# EAGLE design mini-plasma-driver (EAGLE 9.1.1)
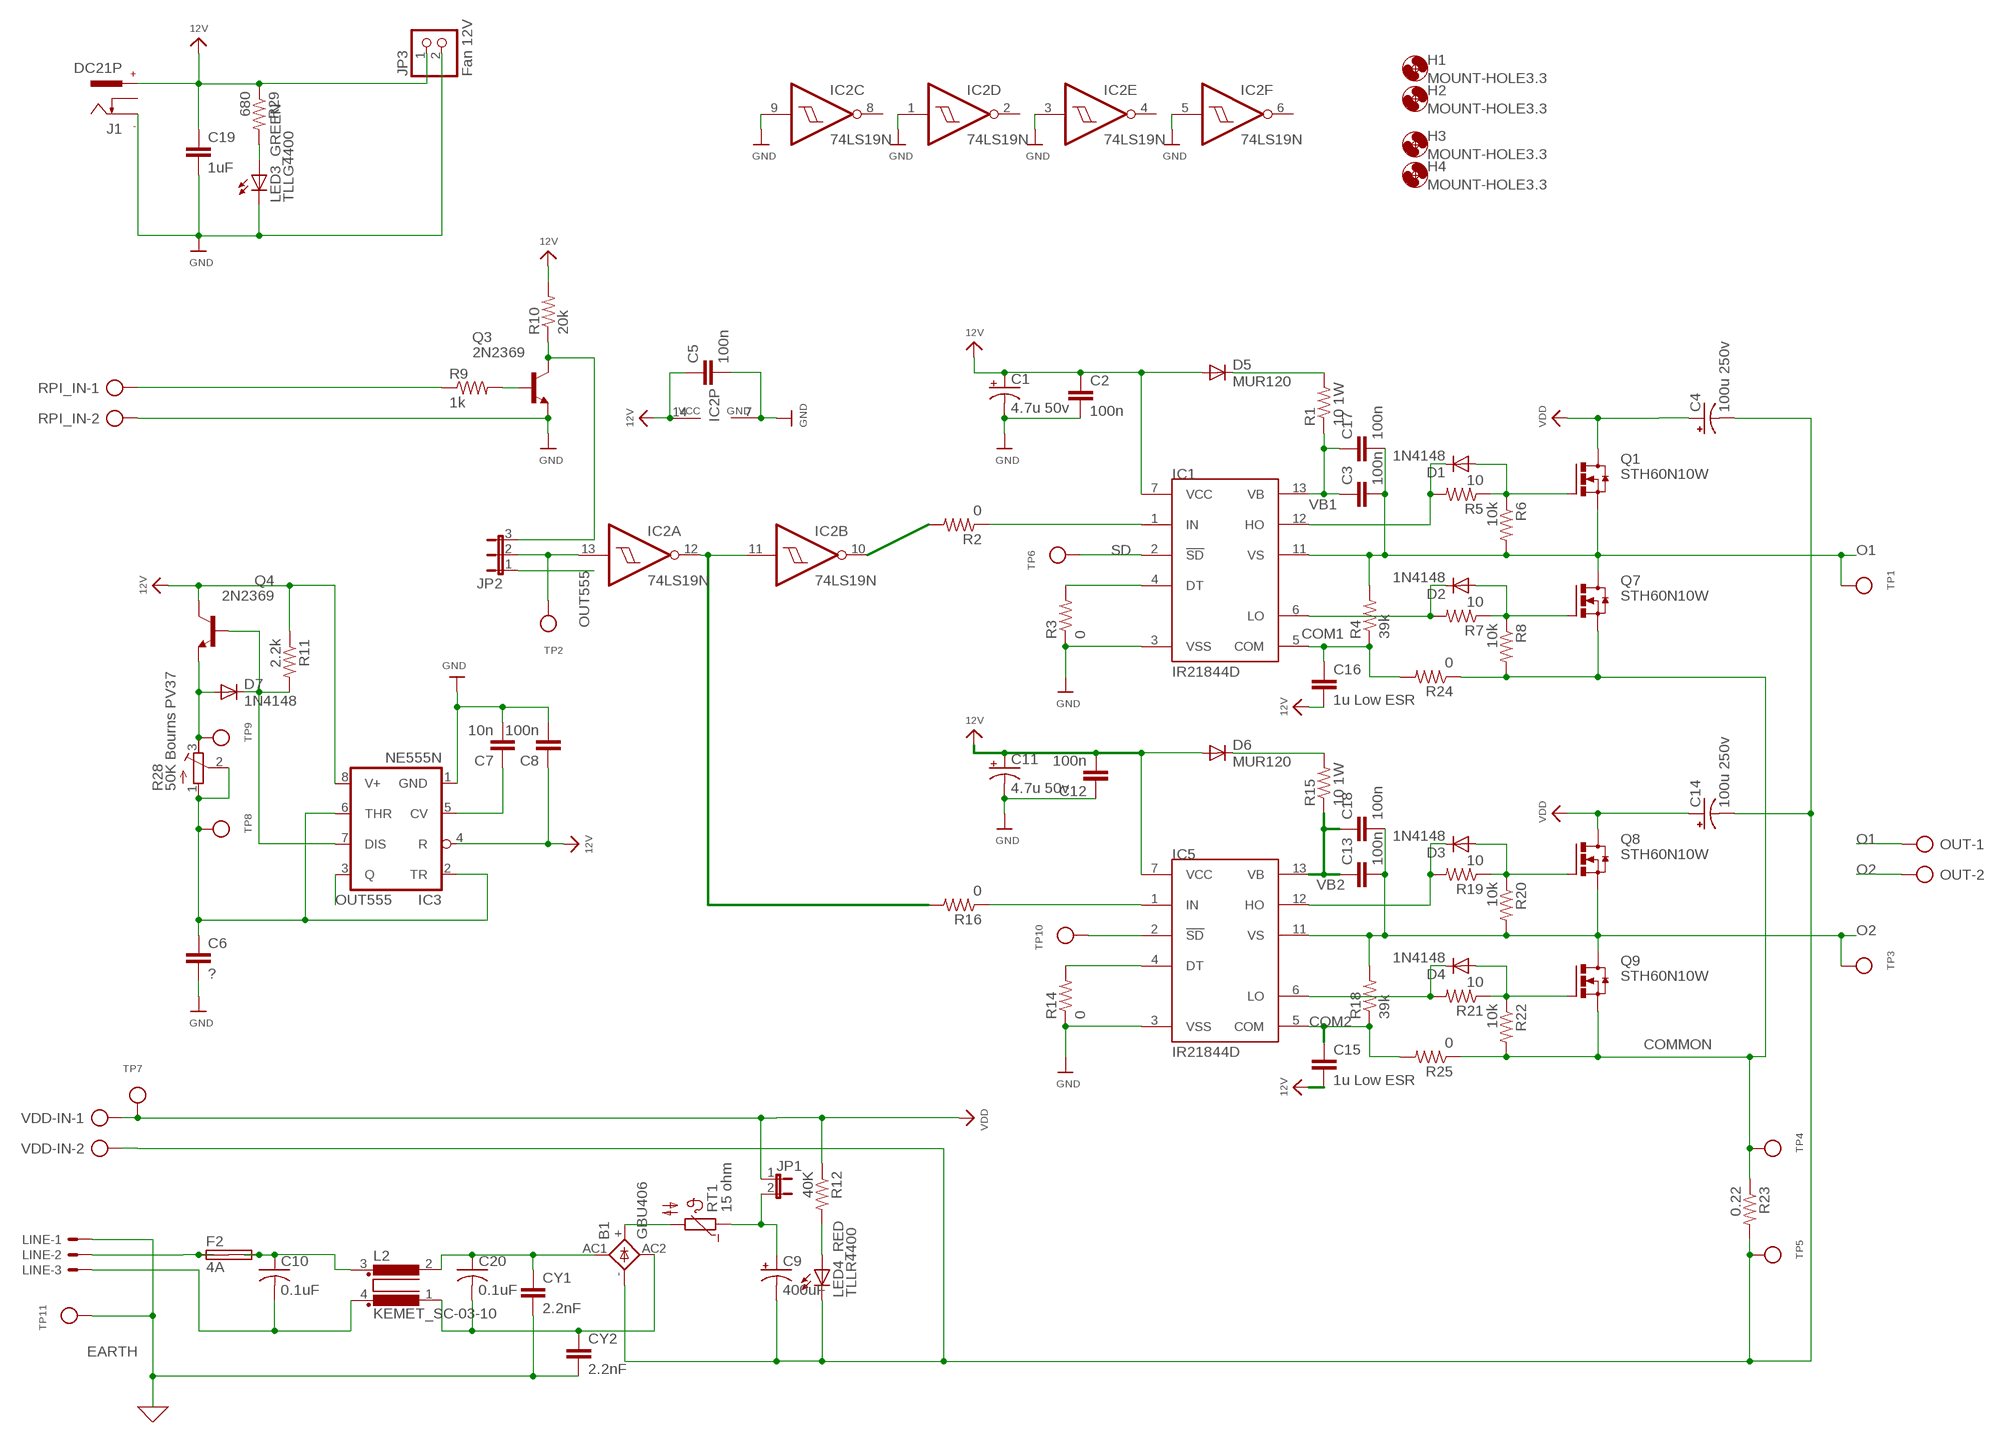
[diagram p0: schematic, sheet 1]

## Parts
B1  GBU406  2KBB-R  [2KBB-R]
C1  4.7u 50v  CPOL-USE2-5  [E2-5]
C2  100n  C-EU025-025X050  [C025-025X050]
C3  100n  C-EU025-030X050  [C025-030X050]
C4  100u 250v  CPOL-USE7.5-18  [E7,5-18]
C5  100n  C-EU025-030X050  [C025-030X050]
C6  ?  C-EU025-025X050  [C025-025X050]
C7  10n  C-EU025-030X050  [C025-030X050]
C8  100n  C-EU025-030X050  [C025-030X050]
C9  400uF  CPOL-USE7.5-18  [E7,5-18]
C10  0.1uF  C-US150-084X183  [C150-084X183]
C11  4.7u 50v  CPOL-USE2-5  [E2-5]
C12  100n  C-EU025-025X050  [C025-025X050]
C13  100n  C-EU025-030X050  [C025-030X050]
C14  100u 250v  CPOL-USE7.5-18  [E7,5-18]
C15  1u Low ESR  C-EU025-025X050  [C025-025X050]
C16  1u Low ESR  C-EU025-025X050  [C025-025X050]
C17  100n  C-EU025-030X050  [C025-030X050]
C18  100n  C-EU025-030X050  [C025-030X050]
C19  1uF  C-EU025-025X050  [C025-025X050]
C20  0.1uF  C-US150-084X183  [C150-084X183]
CY1  2.2nF  C-EU025-025X050  [C025-025X050]
CY2  2.2nF  C-EU025-025X050  [C025-025X050]
D1  1N4148  1N4148DO35-10  [DO35-10]
D2  1N4148  1N4148DO35-10  [DO35-10]
D3  1N4148  1N4148DO35-10  [DO35-10]
D4  1N4148  1N4148DO35-10  [DO35-10]
D5  MUR120  VERTICAL-DIODE  [0309V]
D6  MUR120  VERTICAL-DIODE  [0309V]
D7  1N4148  1N4148DO35-10  [DO35-10]
F2  4A  SHK20Q  [SHK20Q]
H1  MOUNT-HOLE3.3  [3,3]
H2  MOUNT-HOLE3.3  [3,3]
H3  MOUNT-HOLE3.3  [3,3]
H4  MOUNT-HOLE3.3  [3,3]
IC1  IR21844D  [DIL14]
IC2  74LS19N  [DIL14]
IC3  NE555N  [DIL08]
IC5  IR21844D  [DIL14]
J1  DC21P  [CUI-PJ-102AH]
JP1  JP1E  [JP1]
JP2  JP2E  [JP2]
JP3  Fan 12V  PINHD-1X2  [1X02]
L2  KEMET_SC-03-10  [KEMET_SC-03-10]
LED3_GREEN  TLLG4400  [LED3MM]
LED4_RED  TLLR4400  [LED3MM]
LINE  KK-156-3  [KK-156-3]
OUT  AK500/2  [AK500/2]
Q1  STH60N10W  [TO-247AD-V]
Q3  2N2369  [TO18]
Q4  2N2369  [TO18]
Q7  STH60N10W  [TO-247AD-V]
Q8  STH60N10W  [TO-247AD-V]
Q9  STH60N10W  [TO-247AD-V]
R1  10 1W  R-US_0309/V  [0309V]
R2  0  R-US_0207/10  [0207/10]
R3  0  R-US_0309/V  [0309V]
R4  39k  R-US_0207/10  [0207/10]
R5  10  R-US_0207/10  [0207/10]
R6  10k  R-US_0207/10  [0207/10]
R7  10  R-US_0207/10  [0207/10]
R8  10k  R-US_0207/10  [0207/10]
R9  1k  R-US_0207/10  [0207/10]
R10  20k  R-US_0207/10  [0207/10]
R11  2.2k  R-US_0207/10  [0207/10]
R12  40K  R-US_0207/10  [0207/10]
R14  0  R-US_0309/V  [0309V]
R15  10 1W  R-US_0309/V  [0309V]
R16  0  R-US_0207/10  [0207/10]
R18  39k  R-US_0207/10  [0207/10]
R19  10  R-US_0207/10  [0207/10]
R20  10k  R-US_0207/10  [0207/10]
R21  10  R-US_0207/10  [0207/10]
R22  10k  R-US_0207/10  [0207/10]
R23  0.22  R-US_0617/17  [0617/17]
R24  0  R-US_0207/10  [0207/10]
R25  0  R-US_0207/10  [0207/10]
R28  50K Bourns PV37  R-TRIMM3296Y  [RTRIM3296Y]
R29  680  R-US_0207/10  [0207/10]
RPI_IN  AK500/2  [AK500/2]
RT1  15 ohm  B57164  [B57164]
TP1  TESTPOINT0.1"  [1X01_ROUND]
TP2  TESTPOINT0.1"  [1X01_ROUND]
TP3  TESTPOINT0.1"  [1X01_ROUND]
TP4  TESTPOINT0.1"  [1X01_ROUND]
TP5  TESTPOINT0.1"  [1X01_ROUND]
TP6  TESTPOINT0.1"  [1X01_ROUND]
TP7  TESTPOINT0.1"  [1X01_ROUND]
TP8  TESTPOINT0.1"  [1X01_ROUND]
TP9  TESTPOINT0.1"  [1X01_ROUND]
TP10  TESTPOINT0.1"  [1X01_ROUND]
TP11  TESTPOINT0.1"  [1X01_ROUND]
VDD-IN  AK500/2  [AK500/2]

## Nets
12V: C1.+ C2.1 C5.1 C8.1 C11.+ C12.2 C15.2 C16.2 C19.1 D5.A D6.A IC1.7(VCC) IC2.14(P:VCC) IC3.4(R) IC3.8(V+) IC5.7(VCC) J1.+ JP3.1 Q4.3(C) R10.2 R11.1 R29.1
COM1: C16.1 IC1.5(COM) R4.1 R24.2
COM2: C15.1 IC5.5(COM) R18.1 R25.2
COMMON: Q7.S Q9.S R8.2 R22.2 R23.1 R24.1 R25.1 TP4.1
EARTH: CY1.2 CY2.2 LINE.1 TP11.1 ; supply symbol labelled GND
GND: C1.- C2.2 C5.2 C6.2 C7.2 C8.2 C11.- C12.1 C19.2 IC1.3(VSS) IC2.1(D:I) IC2.3(E:I) IC2.5(F:I) IC2.7(P:GND) IC2.9(C:I) IC3.1(GND) IC5.3(VSS) J1.- JP3.2 LED3_GREEN.K(C) Q3.1(E) R3.1 R14.1 RPI_IN.2
N$1: D5.C R1.2
N$2: C9.+ JP1.2 RT1.1
N$3: IC1.1(IN) R2.1
N$4: IC2.10(B:O) R2.2
N$5: D1.C IC1.12(HO) R5.2
N$6: IC1.4(DT) R3.2
N$7: D1.A Q1.G R5.1 R6.1
N$8: D2.C IC1.6(LO) R7.2
N$9: D2.A Q7.G R7.1 R8.1
N$10: R9.1 RPI_IN.1
N$11: Q3.2(B) R9.2
N$12: JP2.3 Q3.3(C) R10.1
N$13: IC2.13(A:I) JP2.2 TP2.1
N$14: D7.C IC3.7(DIS) Q4.2(B) R11.2
N$15: C6.1 IC3.2(TR) IC3.6(THR) R28.1(A) R28.2(S) TP8.1
N$16: D7.A Q4.1(E) R28.3(E) TP9.1
N$17: C7.1 IC3.5(CV)
N$18: C10.1 F2.2A F2.2B L2.3
N$19: F2.1A F2.1B LINE.2
N$20: B1.AC1 C20.1 CY1.1 L2.2
N$21: D6.C R15.2
N$22: C10.2 L2.4 LINE.3
N$23: IC5.1(IN) R16.1
N$25: B1.+ RT1.2
N$26: IC5.4(DT) R14.2
N$27: D3.C IC5.12(HO) R19.2
N$28: D3.A Q8.G R19.1 R20.1
N$29: D4.C IC5.6(LO) R21.2
N$30: D4.A Q9.G R21.1 R22.1
N$31: B1.AC2 C20.2 CY2.1 L2.1
N$32: LED4_RED.A R12.2
N$33: IC5.2(!SD) TP10.1
N$34: LED3_GREEN.A R29.2
N$36: IC2.11(B:I) IC2.12(A:O) R16.2
O1: C3.2 C17.2 IC1.11(VS) OUT.1 Q1.S Q7.D R4.2 R6.2 TP1.1
O2: C13.2 C18.2 IC5.11(VS) OUT.2 Q8.S Q9.D R18.2 R20.2 TP3.1
OUT555: IC3.3(Q) JP2.1
SD: IC1.2(!SD) TP6.1
VB1: C3.1 C17.1 IC1.13(VB) R1.1
VB2: C13.1 C18.1 IC5.13(VB) R15.1
VDD+: C4.+ C14.+ JP1.1 Q1.D Q8.D R12.1 TP7.1 VDD-IN.1 ; supply symbol labelled VDD
VDD-: B1.- C4.- C9.- C14.- LED4_RED.K(C) R23.2 TP5.1 VDD-IN.2
Unconnected: IC2.2(D:O) IC2.4(E:O) IC2.6(F:O) IC2.8(C:O) J1.C

## Library data of the parts
B1 = rectifier:2KBB-R: RECTIFIER grid 3 x 5 mm
C1 C4 C9 C11 C14 = rcl:CPOL-US: POLARIZED CAPACITOR, American symbol; SPICEPREFIX: C
C2 C3 C5-C8 C12 C13 C15-C19 CY1 CY2 = rcl:C-EU: CAPACITOR, European symbol; SPICEPREFIX: C
C10 C20 = rcl:C-US: CAPACITOR, American symbol; SPICEPREFIX: C
D1-D4 D7 = diode:1N4148: DIODE high speed (Philips)
D5 D6 = keves-ng:VERTICAL-DIODE
F2 = fuse:SHK20Q: FUSE HOLDER 5 x 20 mm, SH contact, E1207 Buerklin 64G6061; OC_FARNELL: unknown; OC_NEWARK: unknown
H1-H4 = holes:MOUNT-HOLE: MOUNTING HOLE with drill center marker
IC1 IC5 = irs:IR21844
IC2 = 74xx-eu:74*19: Hex schmitt trigger INVERTER
IC3 = linear:*555: TIMER
J1 = keves:DC21P: DC 2.1 mm Power Socket Positive Centre
JP1 = jumper:JP1E: JUMPER
JP2 = jumper:JP2E: JUMPER
JP3 = pinhead:PINHD-1X2: PIN HEADER
L2 = CdF Common:KEMET_SC-03-10: FILTER
LED3_GREEN = led:TLLG4400: Low Current (2mA) LED 3 mm Tinted Diffused Package color GREEN Source: Data sheet <http://www.farnell.com/datasheets/391098.pdf>; MF: VISHAY SEMICONDUCTOR; OC_FARNELL: 1612435
LED4_RED = led:TLLR4400: Low Current (2mA) LED 3 mm Tinted Diffused Package color RED Source: Data sheet <http://www.farnell.com/datasheets/391100.pdf>; MF: VISHAY SEMICONDUCTOR; OC_FARNELL: 1612437
LINE = con-molex:KK-156-3: KK 156 HEADER Source: http://www.molex.com/pdm_docs/sd/026604100_sd.pdf; MF: MOLEX; OC_FARNELL: unknown; OC_NEWARK: unknown
OUT RPI_IN VDD-IN = con-ptr500:AK500/2: CONNECTOR; OC_FARNELL: unknown; OC_NEWARK: unknown
Q1 Q7-Q9 = transistor-power:ST*60N10: N - CHANNEL ENHANCEMENT MODE POWER MOS TRANSISTOR Source: SGS-THOMSON .. STW60N10 1.pdf
Q3 Q4 = transistor-npn:2N2369*: NPN Transistor
R1-R12 R14-R16 R18-R25 R29 = rcl:R-US_: RESISTOR, American symbol; SPICEPREFIX: R
R28 = rcl:R-TRIMM: Trimm resistor; SPICEMODEL: X; SPICEPREFIXL: POT
RT1 = ptc-ntc:B57164: SIEMENS NTC; MPN: B57164K474K52; OC_FARNELL: 9753451; OC_NEWARK: 29M3118
TP1-TP11 = microbuilder:TESTPOINT: Test Point Various test points for characterisation and PCB testing TESTPOINT_SMT - Compact Surface Mount Test Point [Digikey: 5016KTR-ND]; BOM: EXCLUDE

## Board
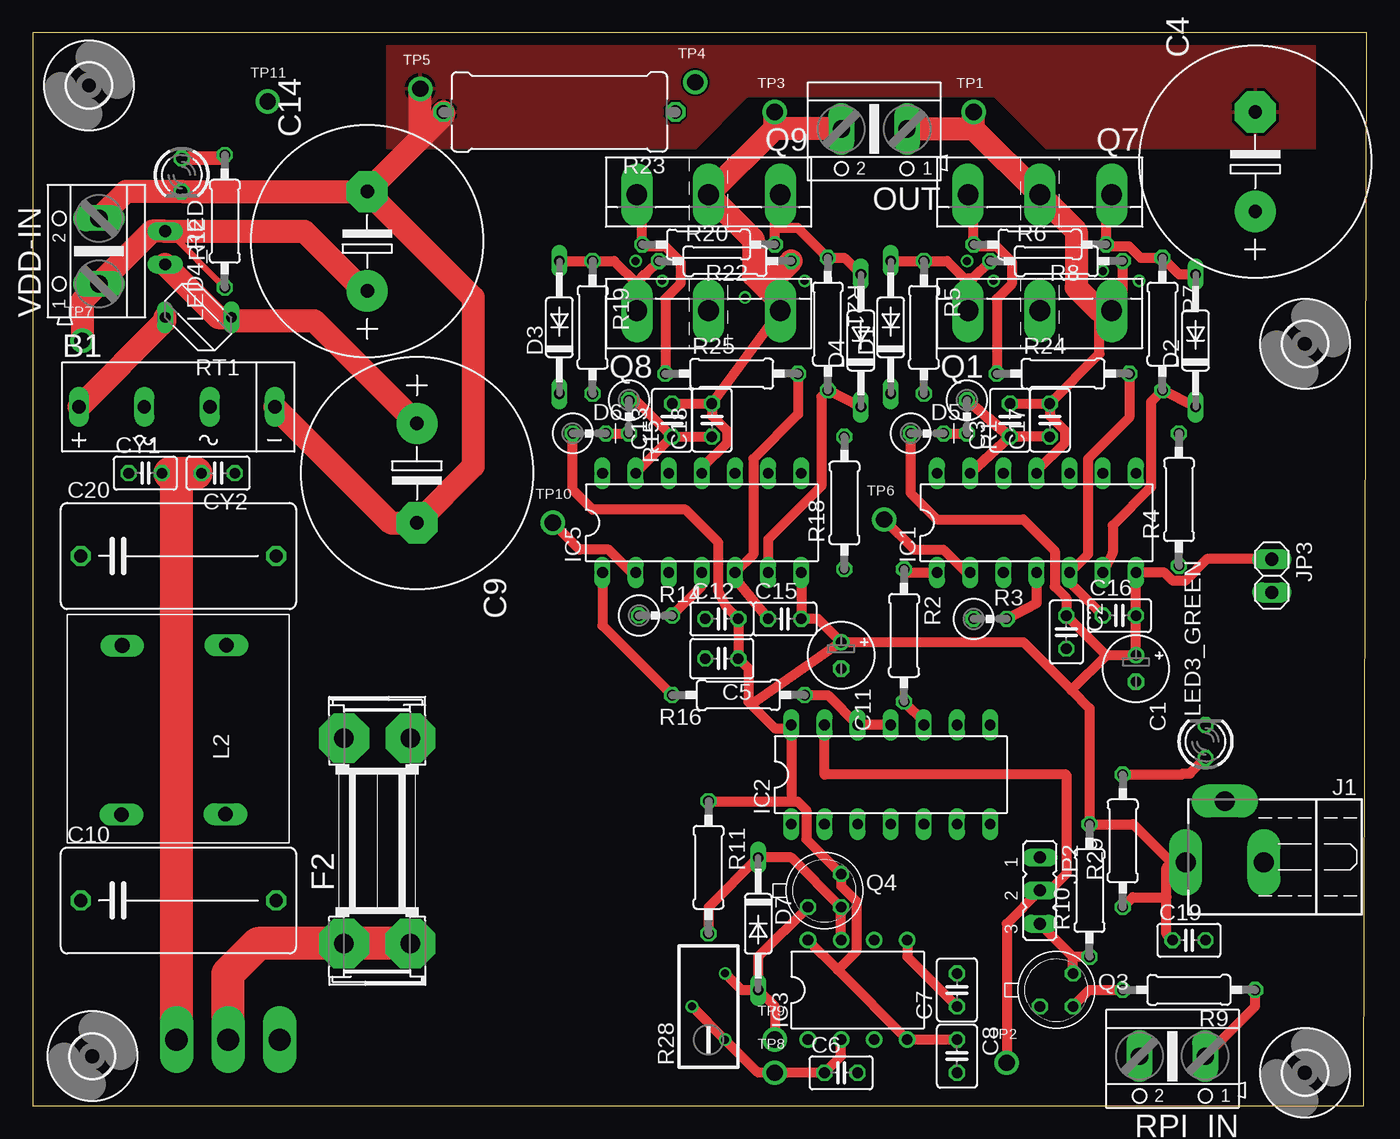
[diagram p1: board, top side]
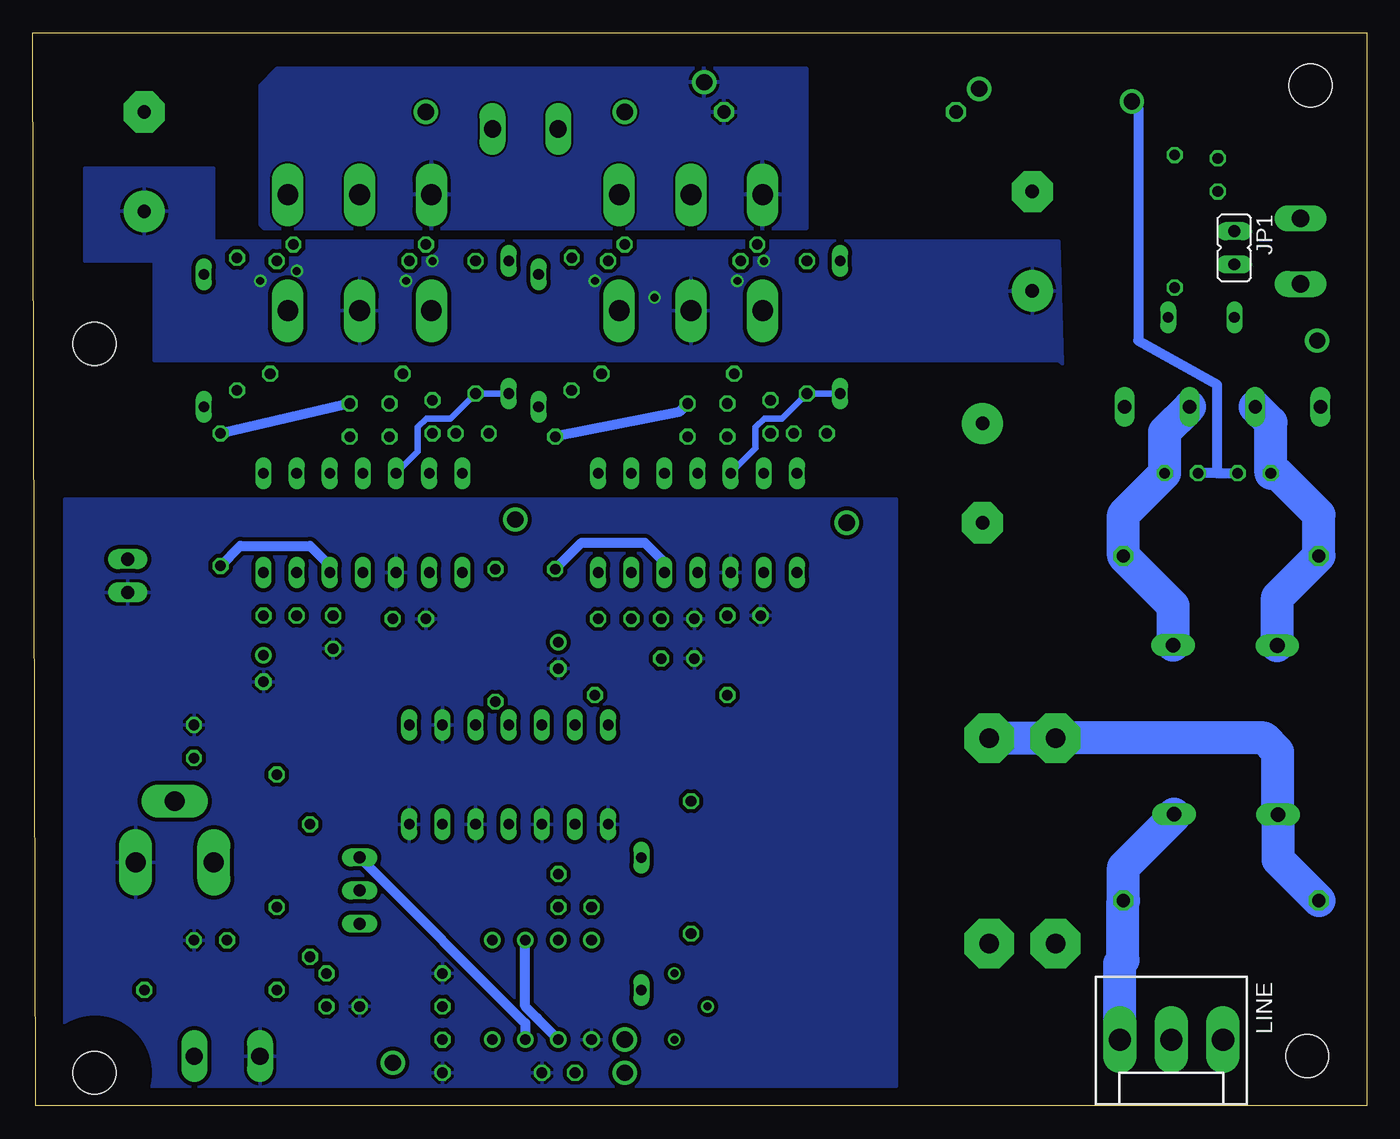
[diagram p2: board, bottom side, seen from below]

Size 102.29 x 82.29 mm. Coordinates in mm from the lower left corner, seen from the top.
Outline: 0,0 102.03,0 102.29,82.29 0,82.29 0,0
Copper layers (1*16): Top 0.0356mm / dielectric 1.5011mm / Bottom 0.0356mm
Design rules "oshpark-2layer-2017-05": minimum track width 6mil, minimum drill 13mil, track to track 6mil, track to pad 6mil, pad to pad 6mil, via to via 6mil, smd to smd 6mil, copper to edge 15mil, drill to drill 6mil, minimum pad ring 7mil, minimum via ring 7mil, stop-mask expansion 2.5mil, vias tented up to drill 0mil, thermal gap 10mil

### Footprints (pad centres in the part's own frame; a part is rotated, then mirrored left to right if it is on the bottom)
2KBB-R = drill 1.016 long: + -7.62,0; - 7.391,0; AC1 -2.616,0; AC2 2.413,0
E2-5 = drill 0.813 pad 1.27: + -1.016,0 | drill 0.813 pad 1.27 octagon: - 1.016,0
C025-025X050 = drill 0.813 octagon: 1 -1.27,0; 2 1.27,0
C025-030X050 = drill 0.813 octagon: 1 -1.27,0; 2 1.27,0
E7,5-18 = drill 1.016 pad 3.15: + -3.81,0 | drill 1.016 pad 3.15 octagon: - 3.81,0
C150-084X183 = drill 1.016 octagon: 1 -7.493,0; 2 7.493,0
DO35-10 = drill 0.813 long: A 5.08,0; C -5.08,0
0309V = drill 0.813 octagon: A -1.27,0; C 1.27,0
SHK20Q = drill 1.5 pad 3.81 octagon: 1A -7.874,2.54; 1B -7.874,-2.54; 2A 7.874,2.54; 2B 7.874,-2.54
3,3 = hole 3.3: 0,0
DIL14 = drill 0.813 long: 1 -7.62,-3.81; 2 -5.08,-3.81; 3 -2.54,-3.81; 4 0,-3.81; 5 2.54,-3.81; 6 5.08,-3.81; 7 7.62,-3.81; 8 7.62,3.81; 9 5.08,3.81; 10 2.54,3.81; 11 0,3.81; 12 -2.54,3.81; 13 -5.08,3.81; 14 -7.62,3.81
DIL08 = drill 0.813 pad 1.27: 1 -3.81,-3.81; 2 -1.27,-3.81; 3 1.27,-3.81; 4 3.81,-3.81; 5 3.81,3.81; 6 1.27,3.81; 7 -1.27,3.81; 8 -3.81,3.81
CUI-PJ-102AH = drill 1.524 pad 2.54 long: + 4.7,0; - 4.7,6; C 0,3
JP1 = drill 0.914 long: 1 0,-1.27; 2 0,1.27
JP2 = drill 0.914 long: 1 -2.54,0; 2 0,0; 3 2.54,0
1X02 = drill 1.016 long: 1 -1.27,0; 2 1.27,0
KEMET_SC-03-10 = drill 1.118 long: 1 -8.65,5.218; 2 -8.63,-2.783; 3 4.324,-2.832; 4 4.304,5.142
LED3MM = drill 0.813 octagon: A -1.27,0; K 1.27,0
KK-156-3 = drill 1.7 pad 2.184 long: 1 -3.96,0; 2 0,0; 3 3.96,0
AK500/2 = drill 1.321 long: 1 -2.515,0; 2 2.515,0
TO-247AD-V = drill 1.6 long: D 0,-2.54; G -5.5,-2.54; S 5.5,-2.54
TO18 = drill 0.813 octagon: 1 -1.27,-1.27; 2 1.27,-1.27; 3 1.27,1.27
0309V' = drill 0.813 octagon: 1 -1.27,0; 2 1.27,0
0207/10 = drill 0.813 octagon: 1 -5.08,0; 2 5.08,0
0617/17 = drill 1.016 octagon: 1 -8.89,0; 2 8.89,0
RTRIM3296Y = drill 0.61: 1 1.27,-2.54; 2 -1.27,0; 3 1.27,2.54
B57164 = drill 0.813 long: 1 -2.54,0; 2 2.54,0
1X01_ROUND = drill 1.245 pad 1.676: 1 0,0

### Placement (x,y rotation side)
B1  11.18,53.59 0 top
C1  84.58,33.53 270 top
C2  79.25,36.32 270 top
C3  74.93,52.58 90 top
C4  93.73,72.39 90 top
C5  52.83,34.29 180 top
C6  61.98,2.54 0 top
C7  70.87,8.89 90 top
C8  70.87,3.81 270 top
C9  29.46,48.51 270 top
C10  11.18,15.75 0 top
C11  61.98,34.54 270 top
C12  52.83,37.34 0 top
C13  49.02,52.58 90 top
C14  25.65,66.29 90 top
C15  57.66,37.34 0 top
C16  83.31,37.59 0 top
C17  77.98,52.58 90 top
C18  52.07,52.58 90 top
C19  88.65,12.7 0 top
C20  11.18,42.16 0 top
CY1  8.64,48.51 0 top
CY2  14.22,48.51 180 top
D1  65.79,59.69 90 top
D2  89.15,58.67 90 top
D3  40.39,59.69 90 top
D4  63.5,58.67 90 top
D5  68.58,51.56 0 top
D6  42.67,51.56 0 top
D7  55.63,13.97 270 top
F2  26.42,20.32 90 top
H1  4.57,3.81 0 top
H2  4.32,78.23 0 top
H3  97.54,2.54 0 top
H4  97.54,58.42 0 top
IC1  76.96,44.7 0 top
IC2  65.79,25.4 0 top
IC3  63.25,8.89 0 top
IC5  51.31,44.7 0 top
J1  88.39,23.37 270 top
JP1  10.16,65.79 180 bottom
JP2  77.22,16.51 270 top
JP3  95,40.64 270 top
L2  9.65,26.67 270 top
LED3_GREEN  89.92,27.94 90 top
LED4_RED  11.43,71.37 270 top
LINE  14.99,5.08 180 bottom
OUT  64.52,74.9 180 top
Q1  77.22,63.5 0 top
Q3  78.49,8.89 0 top
Q4  60.71,16.51 0 top
Q7  77.22,67.31 180 top
Q8  51.82,63.5 0 top
Q9  51.82,67.31 180 top
R1  10 1W  [0309V']  71.63,52.83 270 top
R2  66.8,36.07 270 top
R3  0  [0309V']  73.41,37.34 0 top
R4  87.88,46.48 90 top
R5  68.33,59.69 270 top
R6  78.49,64.77 0 top
R7  86.61,59.94 270 top
R8  77.22,66.04 180 top
R9  88.65,8.89 180 top
R10  81.03,16.51 90 top
R11  51.82,18.29 270 top
R12  14.73,67.82 90 top
R14  0  [0309V']  47.75,37.59 0 top
R15  10 1W  [0309V']  45.72,52.83 270 top
R16  54.1,31.5 0 top
R18  62.23,46.23 90 top
R19  42.93,59.69 270 top
R20  53.09,64.77 0 top
R21  60.96,59.94 270.1 top
R22  51.82,66.04 180 top
R23  40.39,76.2 180 top
R24  78.99,56.13 0 top
R25  53.59,56.13 0 top
R28  51.82,7.62 0 top
R29  83.57,20.32 90 top
RPI_IN  87.38,3.81 180 top
RT1  12.7,60.45 180 top
TP1  72.14,76.2 0 top
TP2  74.68,3.3 0 top
TP3  56.9,76.2 0 top
TP4  50.8,78.49 0 top
TP5  29.72,77.98 0 top
TP6  65.28,44.96 0 top
TP7  3.81,58.67 0 top
TP8  56.9,2.54 0 top
TP9  56.9,5.08 0 top
TP10  39.88,44.7 0 top
TP11  18.02,77 0 top
VDD-IN  5.08,65.53 90 top

### Tracks (layer width: path | path; a pad name or v marks a point on that pad's centre or on a via)
12V
  Top 0.762: C19.1 86.92,13.16 86.92,16 | R29.1 84.33,16 86.92,16 | C8.1 IC3.4 61.72,10.41 | IC3.8 61.72,10.41 | 61.72,10.41 63.14,11.84 63.14,15.69 61.98,16.86 Q4.3 59.31,20.45 59.31,22.67 58.64,23.34 58.17,23.34 | 58.17,23.34 51.84,23.34 R11.1 | IC2.14 58.17,28.96 | 55.12,30.73 54.86,30.99 54.86,33.53 C5.1 C12.2 53.2,38.24 52.58,39.49 52.58,43.18 50.04,45.72 42.93,45.72 41.4,47.24 D6.A | 55.12,30.73 56.9,28.96 58.17,28.96 | JP3.1 90.01,41.91 88.36,40.26 87.41,40.26 86.78,40.89 IC1.7 C16.2 C1.+ 82.3,34.54 | IC5.7 58.93,37.59 58.99,37.59 C15.2 60.2,37.34 C11.+ | 82.3,34.54 C2.1 79.25,38.92 78.36,39.81 78.36,42.55 75.95,44.96 69.34,44.96 67.31,46.99 D5.A | 58.17,28.96 58.17,23.34 | C11.+ 55.37,30.99 55.12,30.73 | C11.+ 75.95,35.56 79.63,31.88 | 79.63,31.88 81.03,30.48 R10.2 84.38,21.59 87.3,18.67 | 82.3,34.54 79.63,31.88 | 87.3,18.67 J1.+ | 86.92,16 86.92,18.29 87.3,18.67
COM1
  Top 0.762: R24.2 84.07,52.77 80.9,49.6 80.9,43.94 80.9,42.29 IC1.5 79.5,40.13 C16.1
  Bottom 0.762: R4.1 86.36,42.93 81.03,42.93 79.76,41.66 79.5,41.66 IC1.5
COM2
  Top 0.762: R25.2 58.67,53.03 55.24,49.6 55.24,42.29 IC5.5 53.85,40.42 C15.1
  Bottom 0.762: R18.1 60.2,43.18 55.37,43.18 53.85,41.66 IC5.5
COMMON
  Top 0.762: Q9.S 46.74,69.43 R22.2 46.86,65.91 48.48,65.91 49.66,64.73 49.66,63.03 48.51,61.88 R25.1 | R24.1 73.91,61.87 75.06,63.01 75.06,64.73 73.88,65.91 72.26,65.91 R8.2 72.14,69.43 Q7.S
  pour Bottom: 42.93,79.5 83.57,79.5 84.84,78.23 84.84,67.56 84.58,67.31 42.93,67.31
EARTH
  Top 0.762: 12.52,48.51 CY2.2
  Top 2.54: LINE.1 11.03,47.39 11.03,47.99 10.52,48.5 10.53,48.51 12.52,48.51
  Bottom 0.762: 11.48,48.51 11.02,48.51 CY1.2 | 11.48,48.51 11.48,55.29 17.53,58.67 17.53,76.51 TP11.1 | 11.48,48.51 CY2.2
GND
  pour Bottom (isolate 0.305): 99.57,1.52 36.07,1.52 36.07,25.15 36.07,46.52 99.82,46.52 99.82,2.03 99.57,2.03
N$1
  Top 0.762: D5.C R1.2
N$2
  Top 1.778: JP1.2 14.22,60.45 RT1.1 15.49,60.2 21.59,60.2 C9.+
N$3
  Top 0.762: R2.1 67.06,40.89 IC1.1
N$4
  Top 0.762: R2.2 68.33,29.46 IC2.10
N$5
  Bottom 0.508: D1.C R5.2 70.23,52.7 72.1,52.7 72.77,52.03 72.77,50.16 IC1.12
N$6
  Top 0.762: R3.2 76.96,38.53 IC1.4
N$7
  Top 0.762: D1.A R5.1 70.1,64.77 71.72,63.16 Q1.G 71.72,63.32 71.63,63.41 72.05,63.41 R6.1
N$8
  Top 0.762: D2.C R7.2 85.73,53.98 85.73,47.43 82.8,44.51 82.8,42.42 IC1.6
N$9
  Top 0.762: Q7.G 82.3,69.43 R8.1 82.42,65.91 84.04,65.91 84.93,65.02 R7.1 87.88,63.75 D2.A
N$10
  Top 0.762: RPI_IN.1 93.73,7.64 R9.1
N$11
  Top 0.762: Q3.2 81.03,8.89 R9.2
N$12
  Top 0.762: Q3.3 79.76,11.43 | 79.76,11.43 JP2.3 | R10.1 79.76,11.43
N$13
  Top 0.762: IC2.13 60.71,25.4 79.25,25.4 79.25,17.78 77.98,16.51 JP2.2 74.68,13.97 TP2.1
N$14
  Top 0.762: IC3.7 Q4.2 58.17,19.05 D7.C 51.82,15.24 R11.2
N$15
  Top 0.762: IC3.2 61.98,3.81 C6.1 TP8.1 55.63,2.54 R28.1 R28.2
  Bottom 0.762: IC3.2 63.6,6.71 63.6,6.73 64.52,7.64 IC3.6
N$16
  Top 0.762: R28.3 54.36,8.89 D7.A | D7.A 56.9,7.62 TP9.1 | Q4.1 55.63,11.43 D7.A
N$17
  Top 0.762: IC3.5 67.06,11.43 C7.1
N$18
  Bottom 0.762: F2.2A 23.37,28.19 | L2.3 6.83,22.34 6.83,22.3
  Bottom 2.54: F2.2B 23.37,28.19 7.87,28.19 6.83,27.15 6.83,22.3 | L2.3 6.82,18.89 C10.1
N$19
  Top 2.54: F2.1B F2.1A 17.27,12.45 14.99,10.16 LINE.2
N$20
  Bottom 2.54: B1.AC1 7.37,52.4 CY1.1 6.86,48.51 3.68,45.34 C20.1 6.86,38.99 L2.2
N$21
  Top 0.762: D6.C R15.2
N$22
  Bottom 2.54: LINE.3 18.95,10.92 18.69,11.18 18.69,15.72 C10.2 18.67,18.29 14.79,22.16 L2.4
N$23
  Top 0.762: IC5.1 43.69,36.83 R16.1
N$25
  Top 1.778: B1.+ 10.16,60.2 RT1.2
N$26
  Top 0.762: R14.2 51.31,39.88 IC5.4
N$27
  Bottom 0.508: D3.C R19.2 44.83,52.7 46.19,52.7 46.86,52.03 46.86,50.42 IC5.12
N$28
  Top 0.762: D3.A R19.1 44.58,64.77 46.32,63.03 Q8.G 46.32,63.12 46.99,63.79 47.03,63.79 R20.1
N$29
  Top 0.762: D4.C R21.2 60.46,54.36 60.46,47.51 56.39,43.43 IC5.6
N$30
  Top 0.762: R22.1 56.9,67.31 | 56.9,67.31 56.9,69.43 Q9.G | D4.A 62.23,65.02 R21.1 58.66,67.31 56.9,67.31
N$31
  Bottom 2.54: B1.AC2 15.49,51.69 CY2.1 18.67,45.34 C20.2 14.86,38.35 14.86,35.33 L2.1
N$32
  Top 1.016: R12.2 14.48,72.64 LED4_RED.A
N$33
  Top 0.762: IC5.2 45.91,40.89 44.16,42.65 41.93,42.65 TP10.1
N$34
  Top 0.762: R29.2 88.08,25.4 88.15,25.48 88.72,25.48 LED3_GREEN.A
N$36
  Top 0.762: R16.2 60.96,31.5 IC2.12 IC2.11
O1
  Top 0.762: C3.2 C17.2 | C17.2 77.98,52.92 79.12,51.78 79.12,50.84 76.96,48.68 IC1.11 | R6.2 83.57,61.81 Q1.S 81.79,60.96 81.79,57.66 C17.2
  Top 1.778: 72.17,74.9 Q7.D 80.01,67.06 80.01,62.74 81.79,60.96 | 72.17,74.9 OUT.1 | 72.17,74.9 72.14,74.93 TP1.1
  Bottom 0.762: C17.2 R4.2
O2
  Top 0.762: C13.2 C18.2 | C18.2 52.07,52.92 53.21,51.78 53.21,50.84 51.31,48.93 IC5.11 | C18.2 Q8.S
  Top 1.778: 56.9,74.93 Q9.D 55.24,66.42 55.24,63.69 | 56.9,74.93 TP3.1 | OUT.2 61.97,74.93 56.9,74.93 | Q8.S 57.32,61.62 55.24,63.69 | R20.2 57.08,63.69 55.24,63.69
  Bottom 0.762: R18.2 52.7,53.21 C18.2
OUT555
  Bottom 0.762: JP2.1 64.52,6.35 IC3.3
SD
  Top 0.762: TP6.1 67.59,42.65 69.82,42.65 71.57,40.89 IC1.2
VB1
  Top 0.152: 74.78,51.43 C3.1
  Top 0.762: C17.1 75.69,51.31
  Top 0.813: R1.1 73.14,52.82 73.96,52.13 74.78,51.43 | 75.69,51.31 C3.1 IC1.13
VB2
  Top 0.762: R15.1 46.23,54.1 C13.1 | C13.1 IC5.13 | C13.1 C18.1
VDD+  (via drill 0.6)
  Top 0.508: 10.41,67.06 R12.1
  Top 1.778: JP1.1 9.12,67.06 VDD-IN.1 3.81,61.75 TP7.1 | JP1.1 10.41,67.06 | JP1.1 20.83,67.06 25.4,62.48 C14.+
  other vias: 71.63,64.77 73.66,63.25 82.04,64.01 84.84,63.25 48.26,63.25 46.23,64.77 59.18,63.25 54.61,61.98
  pour Bottom (isolate 0.305): 23.61,66.29 88.39,66.29 88.39,69.6 88.39,71.88 98.3,71.88 98.3,64.77 92.96,64.77 92.96,57.15 23.64,57.15 23.36,56.87
VDD-
  Top 1.778: B1.- 27.46,44.7 C9.- 33.78,49.02 33.78,61.98 C14.- | VDD-IN.2 7.14,70.1 LED4_RED.K C14.- | C14.- 29.72,74.17 | 29.72,74.17 29.72,76 TP5.1 | 29.72,74.17 31.5,75.95 R23.2
  pour Top: 27.18,81.28 98.3,81.28 98.3,73.41 77.72,73.41 73.75,77.38 54.77,77.38 50.8,73.41 50.55,73.41 27.18,73.41